# Altium project rk3288_backend.PrjPcb
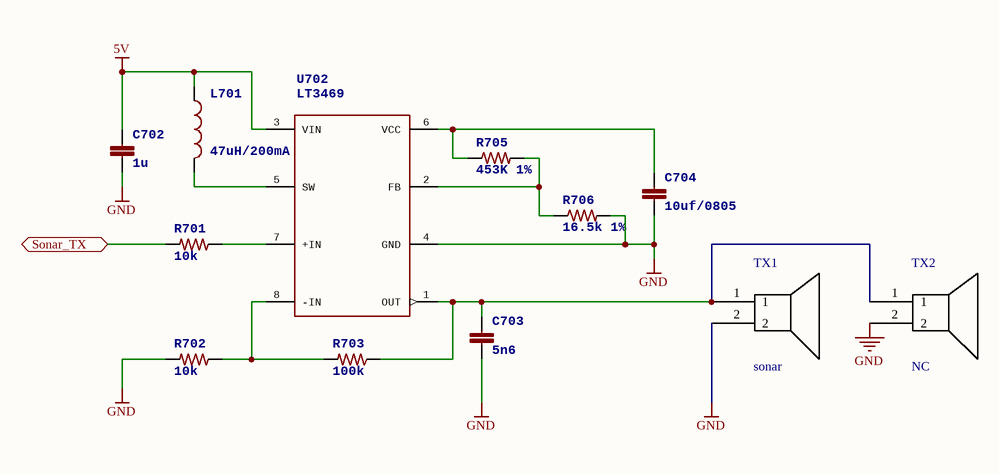
[diagram p0: sonar_tx.SchDoc]
8 sheets, 208 parts. Net scope: flat (ports and power ports of the same name join across sheets).
Board file: rk3288_backend.PcbDoc
Sheets:
  sonar_tx.SchDoc
  sonar_rx.SchDoc
  power.SchDoc
  mcu.SchDoc
  sensor.SchDoc
  connector.SchDoc
  PiAttachment.SchDoc
  rk3288.SchDoc

## Sheet sonar_tx.SchDoc
size A4

### Parts
C702  1u  [0402]
C703  5n6  [0402]
C704  10uf/0805  [0805]
L701  47uH/200mA  [L3521]
R701  10k  [0402]
R702  10k  [0402]
R703  100k  [0402]
R705  453K 1%  [0402]
R706  16.5k 1%  [0402]
TX1  sonar  [sonar-16mm]
TX2  NC  [sonar-10mm]
U702  LT3469  [SOT23-8]

### Ports
Sonar_TX

### Nets
5V: C702.1 L701.1 U702.3(VIN)
GND: C702.2 C703.2 C704.2 R702.2 R706.2 TX1.2 TX2.2 U702.4(GND)
NetC703_1: C703.1 R703.1 TX1.1 TX2.1 U702.1(OUT)
NetC704_1: C704.1 R705.1 U702.6(VCC)
NetL701_2: L701.2 U702.5(SW)
NetMCU1_24: R701.2 ; port Sonar_TX
NetR701_1: R701.1 U702.7(+IN)
NetR702_1: R702.1 R703.2 U702.8(-IN)
NetR705_2: R705.2 R706.1 U702.2(FB)

### Library data of the parts
C702 = CAP0603: <b>Capacitor</b> / Standard 0603 ceramic capacitor, and 0.1" leaded capacitor.; PARTNO: CC0603ZRY5V7BB105
C703 = CAP0402: <b>Capacitor</b> / Standard 0603 ceramic capacitor, and 0.1" leaded capacitor.; PARTNO: C0402C562K5RACTU
C704 = CAP0402: <b>Capacitor</b> / Standard 0603 ceramic capacitor, and 0.1" leaded capacitor.; PARTNO: C1005X5R1C474K050BC
L701 = INDUCTOR0805: <b>Inductors</b> / Basic Inductor/Choke - 0603 and 1210. Footprints are not proven and vary greatly between part numbers. / SRR1210: Bourns SRR1210 parts, e.g. SRR1210-100M; PARTNO: MLZ2012M470W
R701-R703 R705 R706 = RESISTOR0402-RES: <b>Resistor</b> / Basic schematic elements and footprints for 0603, 1206, and PTH 1/10th watt (small) resistors.; PARTNO: RMCF0402FT453K
TX2 = sonar
U702 = LT3469: LT3469 Piezo microactuator driver with boost regulator; PARTNO: LT3469ETS8

## Sheet sonar_rx.SchDoc
size A4
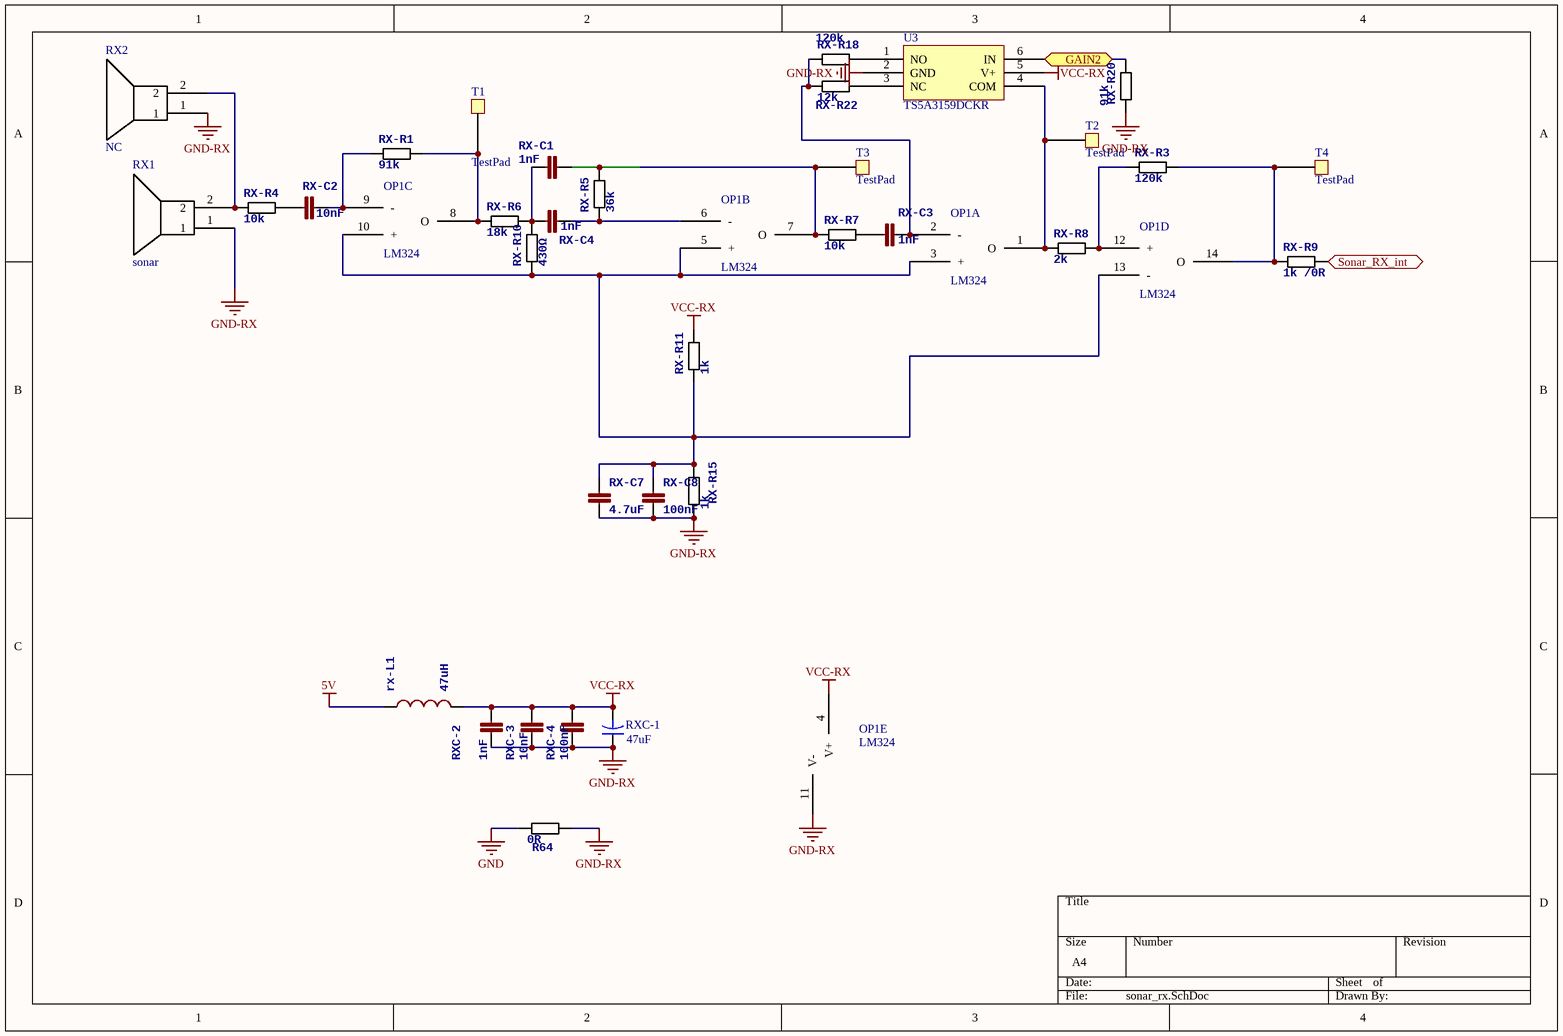
[diagram p1: sonar_rx.SchDoc]

### Parts
OP1  LM324  (parts A,B,C,D,E of 5)
R64  0R  [0402]
RX1  sonar  [sonar-16mm]
RX2  NC  [sonar-10mm]
RX-C1  1nF  [0402]
RX-C2  10nF  [0402]
RX-C3  1nF  [0402]
RX-C4  1nF  [0402]
RX-C7  4.7uF  [0402]
RX-C8  100nF  [0402]
rx-L1  47uH  [0805-IND]
RX-R1  91k  [0402]
RX-R3  120k  [0402]
RX-R4  10k  [0402]
RX-R5  36k  [0402]
RX-R6  18k  [0402]
RX-R7  10k  [0402]
RX-R8  2k  [0402]
RX-R9  1k /0R  [0402]
RX-R10  430Ω  [0402]
RX-R11  1k  [0402]
RX-R15  1k  [0402]
RX-R18  120k  [0402]
RX-R20  91k  [0402]
RX-R22  12k  [0402]
RXC-1  47uF  [C0805]
RXC-2  1nF  [0402]
RXC-3  10nF  [0402]
RXC-4  100nF  [0402]
T1  TestPad  [TestPad - 1mm]
T2  TestPad  [TestPad - 1mm]
T3  TestPad  [TestPad - 1mm]
T4  TestPad  [TestPad - 1mm]
U3  TS5A3159DCKR  [LC-SC-70-6(SOT-363)]

### Ports
GAIN2, Sonar_RX_int

### Nets
5V: rx-L1.1
GND: R64.1
GND-RX: OP1.11(V-) R64.2 RX1.1 RX2.1 RX-C7.2 RX-C8.2 RX-R15.1 RX-R20.1 RXC-1.1 RXC-2.1 RXC-3.1 RXC-4.1 U3.2(GND)
VCC-RX: OP1.4(V+) rx-L1.2 RX-R11.2 RXC-1.2 RXC-2.2 RXC-3.2 RXC-4.2 U3.5(V+)
NetMCU1_25: RX-R9.2 ; port Sonar_RX_int
NetOP1_1: OP1.1(O) RX-R8.1 T2.1 U3.4(COM)
NetOP1_2: OP1.2(-) RX-C3.2 RX-R18.1 RX-R22.1
NetOP1_3: OP1.3(+) OP1.5(+) OP1.10(+) OP1.13(-) RX-C7.1 RX-C8.1 RX-R10.1 RX-R11.1 RX-R15.2
NetOP1_6: OP1.6(-) RX-C4.2 RX-R5.1
NetOP1_7: OP1.7(O) RX-C1.2 RX-R5.2 RX-R7.1 T3.1
NetOP1_8: OP1.8(O) RX-R1.2 RX-R6.1 T1.1
NetOP1_9: OP1.9(-) RX-C2.2 RX-R1.1
NetOP1_12: OP1.12(+) RX-R3.1 RX-R8.2
NetOP1_14: OP1.14(O) RX-R3.2 RX-R9.1 T4.1
NetRX1_2: RX1.2 RX2.2 RX-R4.1
NetRX-C1_1: RX-C1.1 RX-C4.1 RX-R6.2 RX-R10.2
NetRX-C2_1: RX-C2.1 RX-R4.2
NetRX-C3_1: RX-C3.1 RX-R7.2
NetRX-R18_2: RX-R18.2 U3.1(NO)
NetRX-R20_2: RX-R20.2 U3.6(IN) ; port GAIN2
NetRX-R22_2: RX-R22.2 U3.3(NC)

### Library data of the parts
OP1 = OP-SOP14
R64 RX-R1 RX-R3-RX-R11 RX-R15 RX-R18 RX-R20 RX-R22 = RESISTOR0603B: <b>Resistor</b> / Basic schematic elements and footprints for 0603, 1206, and PTH 1/10th watt (small) resistors.; PARTNO: RMCF0402FT453K
RX2 = sonar
RX-C1-RX-C4 RXC-2-RXC-4 = CAP0603H: <b>Capacitor</b> / Standard 0603 ceramic capacitor, and 0.1" leaded capacitor.; PARTNO: CC0603ZRY5V7BB105
RX-C7 RX-C8 = CAP0603: as C702 on sheet sonar_tx
rx-L1 = INDUCTOR0805: as L701 on sheet sonar_tx
RXC-1 = Cap2: Capacitor; Published: 23-Sep-2002; PackageReference: CAPR5-4X5; Publisher: Altium Limited; PackageDescription: Capacitor; 2 Leads; Value: 47uF
U3 = TS5A3159

## Sheet power.SchDoc
size A4
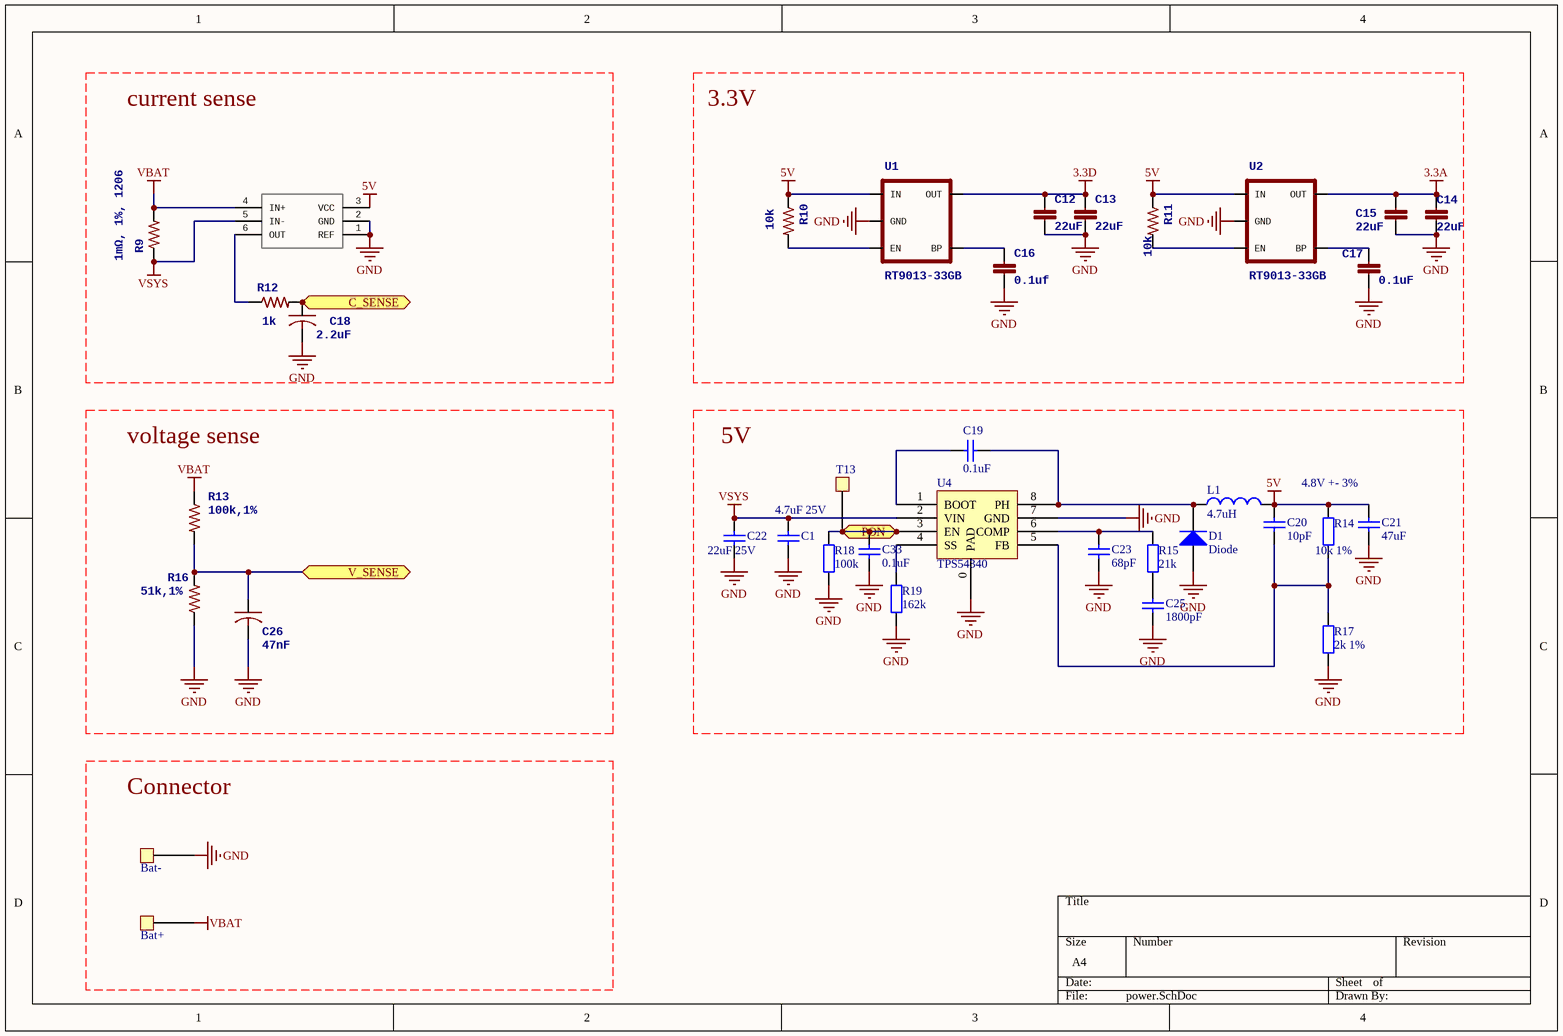
[diagram p2: power.SchDoc]

### Parts
Bat+  TestPad  [BatteryHole]  (value not drawn)
Bat-  TestPad  [BatteryHole]  (value not drawn)
C1  value 4.7uF 25V  [0805]  (hidden comment: Cap)
C12  22uF  [0805]
C13  22uF  [0805]
C14  22uF  [0805]
C15  22uF  [0805]
C16  0.1uf  [0402]
C17  0.1uF  [0402]
C18  2.2uF  [0402]
C19  value 0.1uF  [0402]  (hidden comment: Cap)
C20  value 10pF  [0402]  (hidden comment: Cap)
C21  value 47uF  [1210]  (hidden comment: Cap)
C22  value 22uF 25V  [1210]  (hidden comment: Cap)
C23  value 68pF  [0402]  (hidden comment: Cap)
C25  value 1800pF  [0402]  (hidden comment: Cap)
C26  47nF  [0402]
C33  value 0.1uF  [0402]  (hidden comment: Cap)
D1  Diode  [LC-SMB(DO-214AA)_S1]
L1  value 4.7uH  [L7022]  (hidden comment: Inductor)
R9  1mΩ, 1%, 1206  [1206]
R10  10k  [0402]
R11  10k  [0402]
R12  1k  [0402]
R13  100k,1%  [0402]
R14  value 10k 1%  [0402]  (hidden comment: Res2)
R15  value 21k  [0402]  (hidden comment: Res2)
R16  51k,1%  [0402]
R17  value 2k 1%  [0402]  (hidden comment: Res2)
R18  value 100k  [0402]  (hidden comment: Res2)
R19  value 162k  [0402]  (hidden comment: Res2)
T13  TestPad  [TestPad - 1mm]  (value not drawn)
U1  RT9013-33GB  [SOT23-5]
U2  RT9013-33GB  [SOT23-5]
U4  TPS54340  [D8-Pad]
U6  INA199  [LC-SC-70-6(SOT-363)]  (value not drawn)

### Ports
C_SENSE, PON, V_SENSE

### Nets
3.3A: C14.1 C15.1 U2.5(OUT)
3.3D: C12.1 C13.1 U1.5(OUT)
5V: C20.1 C21.1 L1.2 R10.1 R11.1 R14.1 U1.1(IN) U2.1(IN) U6.3(VCC)
GND: Bat-.1 C1.2 C12.2 C13.2 C14.2 C15.2 C16.2 C17.2 C18.2 C21.2 C22.2 C23.2 C25.2 C26.2 C33.2 D1.1(A) R16.1 R17.2 R18.2 R19.2 U1.2(GND) U2.2(GND) U4.0(PAD) U4.7(GND) U6.1(REF) U6.2(GND)
VBAT: Bat+.1 R9.P$2 R13.1 U6.4(IN+)
VSYS: C1.1 C22.1 R9.P$1 U4.2(VIN) U6.5(IN-)
NetC16_1: C16.1 U1.4(BP)
NetC17_1: C17.1 U2.4(BP)
NetC18_1: C18.1 R12.2 ; port C_SENSE
NetC19_1: C19.1 D1.2(K) L1.1 U4.8(PH)
NetC19_2: C19.2 U4.1(BOOT)
NetC20_2: C20.2 R14.2 R17.1 U4.5(FB)
NetC23_1: C23.1 R15.1 U4.6(COMP)
NetC25_1: C25.1 R15.2
NetC26_1: C26.1 R13.2 R16.2 ; port V_SENSE
NetC33_1: C33.1 R18.1 T13.1 U4.3(EN) ; port PON
NetR10_2: R10.2 U1.3(EN)
NetR11_2: R11.2 U2.3(EN)
NetR12_1: R12.1 U6.6(OUT)
NetR19_1: R19.1 U4.4(SS)

### Notes on the sheet
- current sense
- 3.3V
- voltage sense
- 5V
- 4.8V +- 3%
- Connector

### Library data of the parts
C1 C19-C23 C25 C33 = Cap: Capacitor; Published: 8-Jun-2000; LatestRevisionDate: 17-Jul-2002; LatestRevisionNote: Re-released for DXP Platform.; PackageReference: RAD-0.3; Publisher: Altium Limited; PackageDescription: Radial Cap, Thru-Hole; 2 Leads; 0.3 in Pin Spacing
C12-C17 = CAP0402-CAP: <b>Capacitor</b> / Standard 0603 ceramic capacitor, and 0.1" leaded capacitor.; PARTNO: CC0402ZRY5V7BB104
C18 C26 = C-USC0402: <B>CAPACITOR</B>, American symbol
D1 = Diode: Default Diode; Published: 8-Jun-2000; LatestRevisionDate: 17-Jul-2002; LatestRevisionNote: Re-released for DXP Platform.; PackageVersion: Sep-1996; PackageReference: SMC; Publisher: Altium Limited; PackageDescription: DO-214-AB/SMC; 2 C-Bend Leads; Body 7.9 x 5.9 mm, inc. leads (LxW); Code_JEDEC: DO-214-AB
L1 = Inductor: Code_IEC: 1005; Published: 8-Jun-2000; LatestRevisionDate: 29-May-2009; LatestRevisionNote: IPC-7351 Footprint Added.; PackageReference: 0402-A; Publisher: Altium Limited; PackageDescription: Chip Inductor; Code_JEITA: 0402
R9 = CSS2725FTL250: pin to pad: P$1>2 P$2>1; DIGIKEY: http://search.digikey.com/us/en/products/CSS2725FTL250/CSS2725FTL250CT-ND/1923235; MFGPN: CSS2725FTL250
R10-R13 R16 = RESISTOR0402-RES: <b>Resistor</b> / Basic schematic elements and footprints for 0603, 1206, and PTH resistors.
R14 R15 R17-R19 = Res2: Resistor; Published: 8-Jun-2000; LatestRevisionDate: 17-Jul-2002; LatestRevisionNote: Re-released for DXP Platform.; PackageReference: AXIAL-0.4; Publisher: Altium Limited; PackageDescription: Axial Device, Thru-Hole; 2 Leads; 0.4 in Pin Spacing
U1 = V_REG_LDOSMD: PARTNO: MIC5207-3.3YM5
U2 = V_REG_LDOSMD: <b>Voltage Regulator LDO</b> / Standard 150mA LDO voltage regulator in SOT-23 layout. Micrel part MIC5205. BP (by-pass) pin is used to lower output noise with 470pF cap.; PARTNO: MIC5207-3.3YM5

## Sheet mcu.SchDoc
size A4
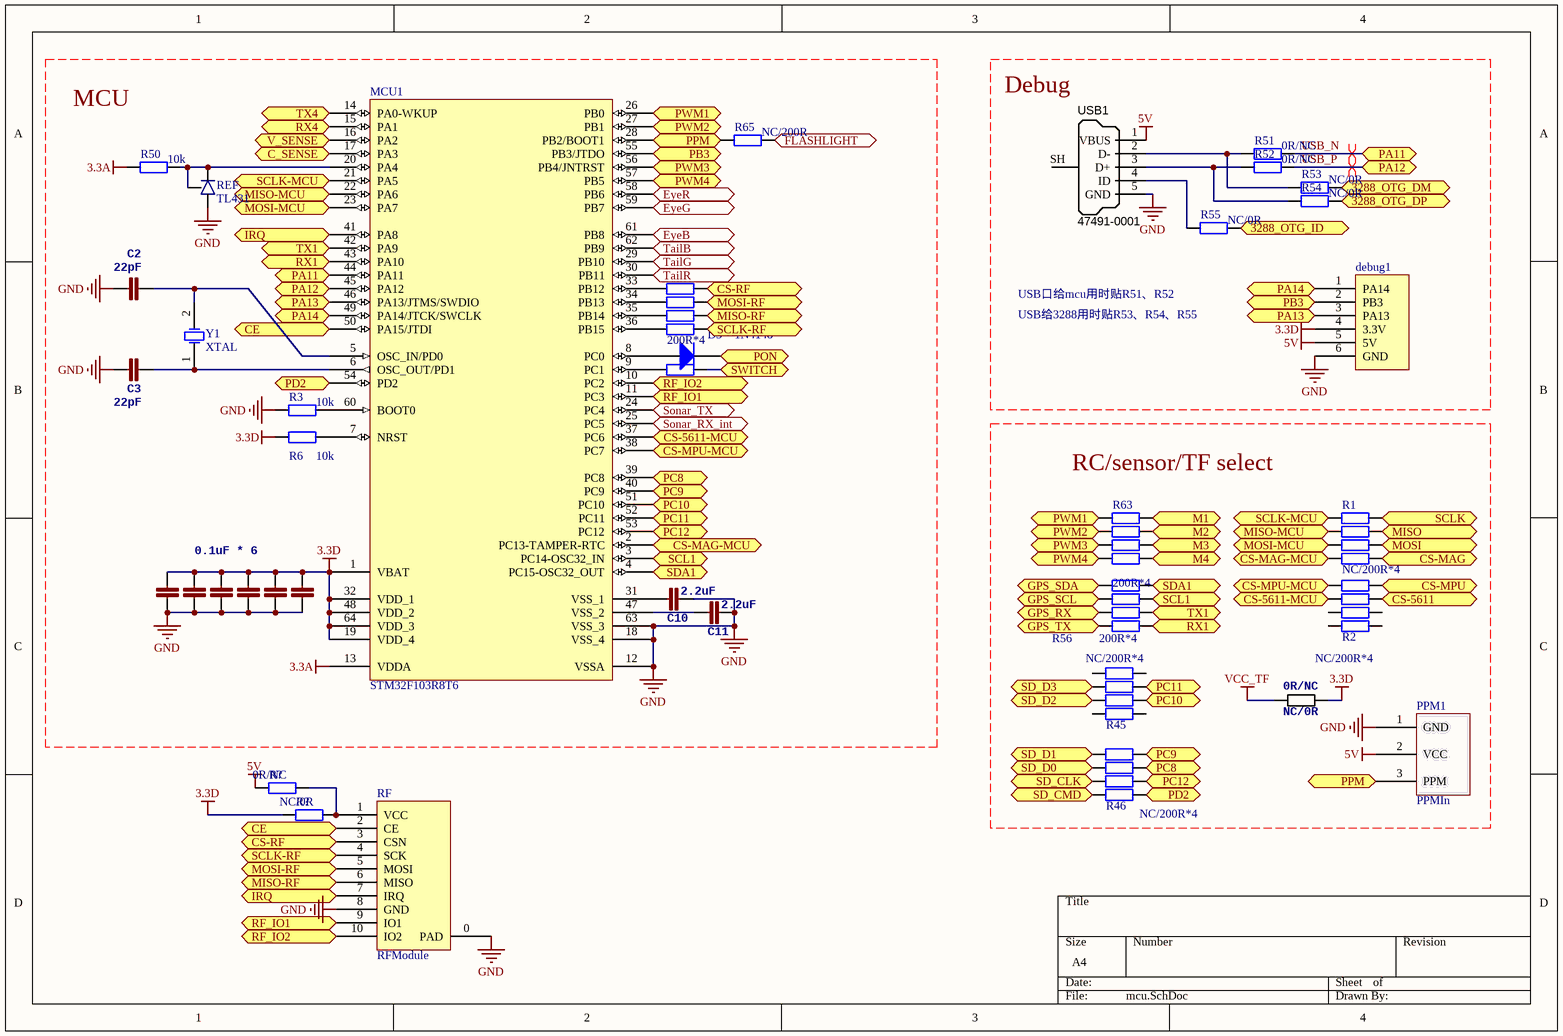
[diagram p3: mcu.SchDoc]

### Parts
(Parts that share a designator on the sheet are numbered #1, #2 ... from top to bottom, then left to right.)
0R/NC  NC/0R  [0402]
C2  22pF  [0402]
C3  22pF  [0402]
C4  0.1uF * 6  [0402]
C5  1n  [0402]  (value not drawn)
C6  1n  [0402]  (value not drawn)
C7  1n  [0402]  (value not drawn)
C8  1n  [0402]  (value not drawn)
C9  1n  [0402]  (value not drawn)
C10  2.2uF  [0603]
C11  2.2uF  [0603]
D3  1N4148  [LC-SOD-323]
debug1  debug  [WFRSM125]  (value not drawn)
MCU1  STM32F103R8T6  [LQFP64_N]
PPM1  PPMIn  [ServoConnector]
R1  NC/200R*4  [0402X4]
R2  NC/200R*4  [0402X4]
R3  10k  [0402]
R6  10k  [0402]
R8  200R*4  [0402X4]
R44  1k  [0402]
R45  NC/200R*4  [0402X4]
R46  NC/200R*4  [0402X4]
R50  10k  [0402]
R51  0R/NC  [0402]
R52  0R/NC  [0402]
R53  NC/0R  [0402]
R54  NC/0R  [0402]
R55  NC/0R  [0402]
R56  200R*4  [0402X4]
R63  200R*4  [0402X4]
R65  NC/200R  [0402]
R?#1  value 0R/NC  [0402]
R?#2  value NC/0R  [0402]
REF  TL431  [SOT-23B_L]
RF  RFModule  [RFModule]
USB1  Manufacturer Part Number 1: 47491-0001  [MOLEX-47346-0001]  (hidden comment: USB Micro Type B)
Y1  XTAL  [5032]

### Ports
3288_OTG_DM, 3288_OTG_DP, 3288_OTG_ID, C_SENSE, CE, CS-5611, CS-5611-MCU, CS-MAG (bidir), CS-MAG-MCU (bidir), CS-MPU, CS-MPU-MCU, CS-RF, EyeB, EyeG, EyeR, FLASHLIGHT, GPS_RX, GPS_SCL, GPS_SDA, GPS_TX, IRQ, M1, M2, M3, M4, MISO, MISO-MCU, MISO-RF, MOSI, MOSI-MCU, MOSI-RF, PA11, PA12, PA13, PA14, PB3, PC8, PC9, PC10, PC11, PC12, PD2, PON, PPM, PWM1, PWM2, PWM3, PWM4, RF_IO1, RF_IO2, RX1, RX4, SCL1, SCLK, SCLK-MCU, SCLK-RF, SD_CLK, SD_CMD, SD_D0, SD_D1, SD_D2, SD_D3, SDA1, Sonar_RX_int, Sonar_TX, SWITCH, TailB, TailG, TailR, TX1, TX4, V_SENSE

### Nets
3.3A: MCU1.13(VDDA) R50.1
3.3D: 0R/NC.2 C4.2 C5.2 C6.2 C7.2 C8.2 C9.2 debug1.4(3.3V) MCU1.1(VBAT) MCU1.19(VDD_4) MCU1.32(VDD_1) MCU1.48(VDD_2) MCU1.64(VDD_3) R6.2 R?#2.1
5V: debug1.5(5V) PPM1.2(VCC) R?#1.1 USB1.1(VBUS)
GND: C2.2 C3.2 C4.1 C5.1 C6.1 C7.1 C8.1 C9.1 C10.2 C11.2 debug1.6(GND) MCU1.12(VSSA) MCU1.18(VSS_4) MCU1.63(VSS_3) PPM1.1(GND) R3.1 REF.3(ANODE) RF.0(PAD) RF.8(GND) USB1.5(GND)
VCC_TF: 0R/NC.1
3288_OTG_N: R53.2 ; port 3288_OTG_DM
3288_OTG_P: R54.2 ; port 3288_OTG_DP
USB_N: MCU1.44(PA11) R51.2 ; port PA11
USB_P: MCU1.45(PA12) R52.2 ; port PA12
NetBaro1_5: R2.7 ; port CS-5611
NetBaro1_6: R1.2 ; port MISO
NetBaro1_7: R1.3 ; port MOSI
NetBaro1_8: R1.1 ; port SCLK
NetC2_1: C2.1 MCU1.5(OSC_IN/PD0) Y1.2(OSC2)
NetC3_1: C3.1 MCU1.6(OSC_OUT/PD1) Y1.1(OSC1)
NetC10_1: C10.1 MCU1.31(VSS_1)
NetC11_1: C11.1 MCU1.47(VSS_2)
NetC18_1: MCU1.17(PA3) ; port C_SENSE
NetC26_1: MCU1.16(PA2) ; port V_SENSE
NetC33_1: D3.2(K) ; port PON
NetD3_1: D3.1(A) MCU1.8(PC0)
NetD4_1: R44.1 ; port SWITCH
Netdebug1_1: debug1.1(PA14) MCU1.49(PA14/JTCK/SWCLK) ; port PA14
Netdebug1_2: debug1.2(PB3) MCU1.55(PB3/JTDO) ; port PB3
Netdebug1_3: debug1.3(PA13) MCU1.46(PA13/JTMS/SWDIO) ; port PA13
NetGPS1_3: R56.8 ; port GPS_TX
NetGPS1_4: R56.7 ; port GPS_RX
NetGPS1_5: R56.6 ; port GPS_SCL
NetGPS1_6: R56.5 ; port GPS_SDA
Netimu1_8: R2.8 ; port CS-MPU
NetM1_2: R63.1 ; port M1
NetM2_2: R63.2 ; port M2
NetM3_2: R63.3 ; port M3
NetM4_2: R63.4 ; port M4
NetMCU1_2: MCU1.2(PC13-TAMPER-RTC) R1.5 ; port CS-MAG-MCU
NetMCU1_3: MCU1.3(PC14-OSC32_IN) R56.3 ; port SCL1
NetMCU1_4: MCU1.4(PC15-OSC32_OUT) R56.4 ; port SDA1
NetMCU1_7: MCU1.7(NRST) R6.1
NetMCU1_9: MCU1.9(PC1) R44.2
NetMCU1_10: MCU1.10(PC2) RF.10(IO2) ; port RF_IO2
NetMCU1_11: MCU1.11(PC3) RF.9(IO1) ; port RF_IO1
NetMCU1_14: MCU1.14(PA0-WKUP) ; port TX4
NetMCU1_15: MCU1.15(PA1) ; port RX4
NetMCU1_20: MCU1.20(PA4) R50.2 REF.1(REF) REF.2(CATHODE)
NetMCU1_21: MCU1.21(PA5) R1.8 ; port SCLK-MCU
NetMCU1_22: MCU1.22(PA6) R1.7 ; port MISO-MCU
NetMCU1_23: MCU1.23(PA7) R1.6 ; port MOSI-MCU
NetMCU1_24: MCU1.24(PC4) ; port Sonar_TX
NetMCU1_25: MCU1.25(PC5) ; port Sonar_RX_int
NetMCU1_26: MCU1.26(PB0) R63.8 ; port PWM1
NetMCU1_27: MCU1.27(PB1) R63.7 ; port PWM2
NetMCU1_28: MCU1.28(PB2/BOOT1) PPM1.3(PPM) R65.1 ; port PPM
NetMCU1_29: MCU1.29(PB10) ; port TailG
NetMCU1_30: MCU1.30(PB11) ; port TailR
NetMCU1_33: MCU1.33(PB12) R8.4
NetMCU1_34: MCU1.34(PB13) R8.3
NetMCU1_35: MCU1.35(PB14) R8.2
NetMCU1_36: MCU1.36(PB15) R8.1
NetMCU1_37: MCU1.37(PC6) R2.2 ; port CS-5611-MCU
NetMCU1_38: MCU1.38(PC7) R2.1 ; port CS-MPU-MCU
NetMCU1_39: MCU1.39(PC8) R46.7 ; port PC8
NetMCU1_40: MCU1.40(PC9) R46.8 ; port PC9
NetMCU1_41: MCU1.41(PA8) RF.7(IRQ) ; port IRQ
NetMCU1_42: MCU1.42(PA9) R56.2 ; port TX1
NetMCU1_43: MCU1.43(PA10) R56.1 ; port RX1
NetMCU1_50: MCU1.50(PA15/JTDI) RF.2(CE) ; port CE
NetMCU1_51: MCU1.51(PC10) R45.6 ; port PC10
NetMCU1_52: MCU1.52(PC11) R45.7 ; port PC11
NetMCU1_53: MCU1.53(PC12) R46.6 ; port PC12
NetMCU1_54: MCU1.54(PD2) R46.5 ; port PD2
NetMCU1_56: MCU1.56(PB4/JNTRST) R63.6 ; port PWM3
NetMCU1_57: MCU1.57(PB5) R63.5 ; port PWM4
NetMCU1_58: MCU1.58(PB6) ; port EyeR
NetMCU1_59: MCU1.59(PB7) ; port EyeG
NetMCU1_60: MCU1.60(BOOT0) R3.2
NetMCU1_61: MCU1.61(PB8) ; port EyeB
NetMCU1_62: MCU1.62(PB9) ; port TailB
NetP5_4: R55.2 ; port 3288_OTG_ID
NetR1_4: R1.4 ; port CS-MAG
NetR8_5: R8.5 RF.3(CSN) ; port CS-RF
NetR8_6: R8.6 RF.5(MOSI) ; port MOSI-RF
NetR8_7: R8.7 RF.6(MISO) ; port MISO-RF
NetR8_8: R8.8 RF.4(SCK) ; port SCLK-RF
NetR43_2: R65.2 ; port FLASHLIGHT
NetR45_2: R45.2 ; port SD_D3
NetR45_3: R45.3 ; port SD_D2
NetR46_1: R46.1 ; port SD_D1
NetR46_2: R46.2 ; port SD_D0
NetR46_3: R46.3 ; port SD_CLK
NetR46_4: R46.4 ; port SD_CMD
NetR51_1: R51.1 R53.1 USB1.2(D-)
NetR52_1: R52.1 R54.1 USB1.3(D+)
NetR55_1: R55.1 USB1.4(ID)
NetR?#1_2: R?#1.2 R?#2.2 RF.1(VCC)

Not connected (* = marked no-connect by the designer): R2 3 4 5 6; R45 1 4 5 8; USB1 SH(Shell)

### Layout directives
differential pair: USB_N, USB_P

### Notes on the sheet
- MCU
- (near USB1) Debug
- USB口给mcu用时贴R51、R52
- USB给3288用时贴R53、R54、R55
- RC/sensor/TF select

### Library data of the parts
0R/NC = RESISTOR0603B: as R64 on sheet sonar_rx
C2-C11 = CAP0402-CAP: as C12 on sheet power
D3 = Diode 1N4148: High Conductance Fast Diode; Published: 8-Jun-2000; LatestRevisionDate: 17-Jul-2002; LatestRevisionNote: Re-released for DXP Platform.; DatasheetVersion: 1997; PackageReference: DO-35; Publisher: Altium Limited; PackageDescription: Diode, Axial; Body 3.8 x 1.9 mm (LxDia. max), Lead Dia. 0.53 mm (max); Code_JEDEC: DO-204-AH; ComponentLink1Description: Manufacturer Link; ComponentLink1URL: http://www.fairchildsemi.com/; ComponentLink2Description: Datasheet; ComponentLink2URL: http://www.fairchildsemi.com/ds/1N%2F1N4148.pdf
MCU1 = STM32F103R8T6: STM32 ARM-based 32-bit MCU with 64 Kbytes Flash, 64-pin LQFP, Industrial Temperature; Published: *; DatasheetVersion: *; PackageVersion: *; PackageReference: *; Publisher: *; PackageDescription: *; ComponentLink1Description: *; ComponentLink1URL: *; ComponentLink2Description: *; ComponentLink2URL: *
R1 R2 R8 R45 R46 R56 R63 = Res*4: Resistor; Published: 8-Jun-2000; LatestRevisionDate: 17-Jul-2002; LatestRevisionNote: Re-released for DXP Platform.; PackageReference: AXIAL-0.4; Publisher: Altium Limited; PackageDescription: Axial Device, Thru-Hole; 2 Leads; 0.4 in Pin Spacing
R3 R6 R44 R50-R55 R65 = Res2: Resistor; Value: 0Ohm; Published: 8-Jun-2000; LatestRevisionDate: 17-Jul-2002; LatestRevisionNote: Re-released for DXP Platform.; PackageReference: AXIAL-0.4; Publisher: Altium Limited; PackageDescription: Axial Device, Thru-Hole; 2 Leads; 0.4 in Pin Spacing
R?#1 R?#2 = Res2: Resistor; Published: 8-Jun-2000; LatestRevisionDate: 17-Jul-2002; LatestRevisionNote: Re-released for DXP Platform.; PackageReference: AXIAL-0.4; Publisher: Altium Limited; PackageDescription: Axial Device, Thru-Hole; 2 Leads; 0.4 in Pin Spacing
USB1 = USB_Micro_TypeB: Connector SMD USB Micro Type B middle mount; Manufacturer 1: Molex Inc; SCDType: undef; Package / Case: SMD; Supplier 1: Digi-Key; Supplier Part Number 1: WM17142CT-ND
Y1 = XTAL: Crystal Oscillator; Published: 8-Jun-2000; LatestRevisionDate: 17-Jul-2002; LatestRevisionNote: Re-released for DXP Platform.; PackageReference: R38; Publisher: Altium Limited; PackageDescription: Crystal, Thru-Hole; 2 Leads; Body 3.1 x 8.2 mm (Dia.xH)

## Sheet sensor.SchDoc
size A4
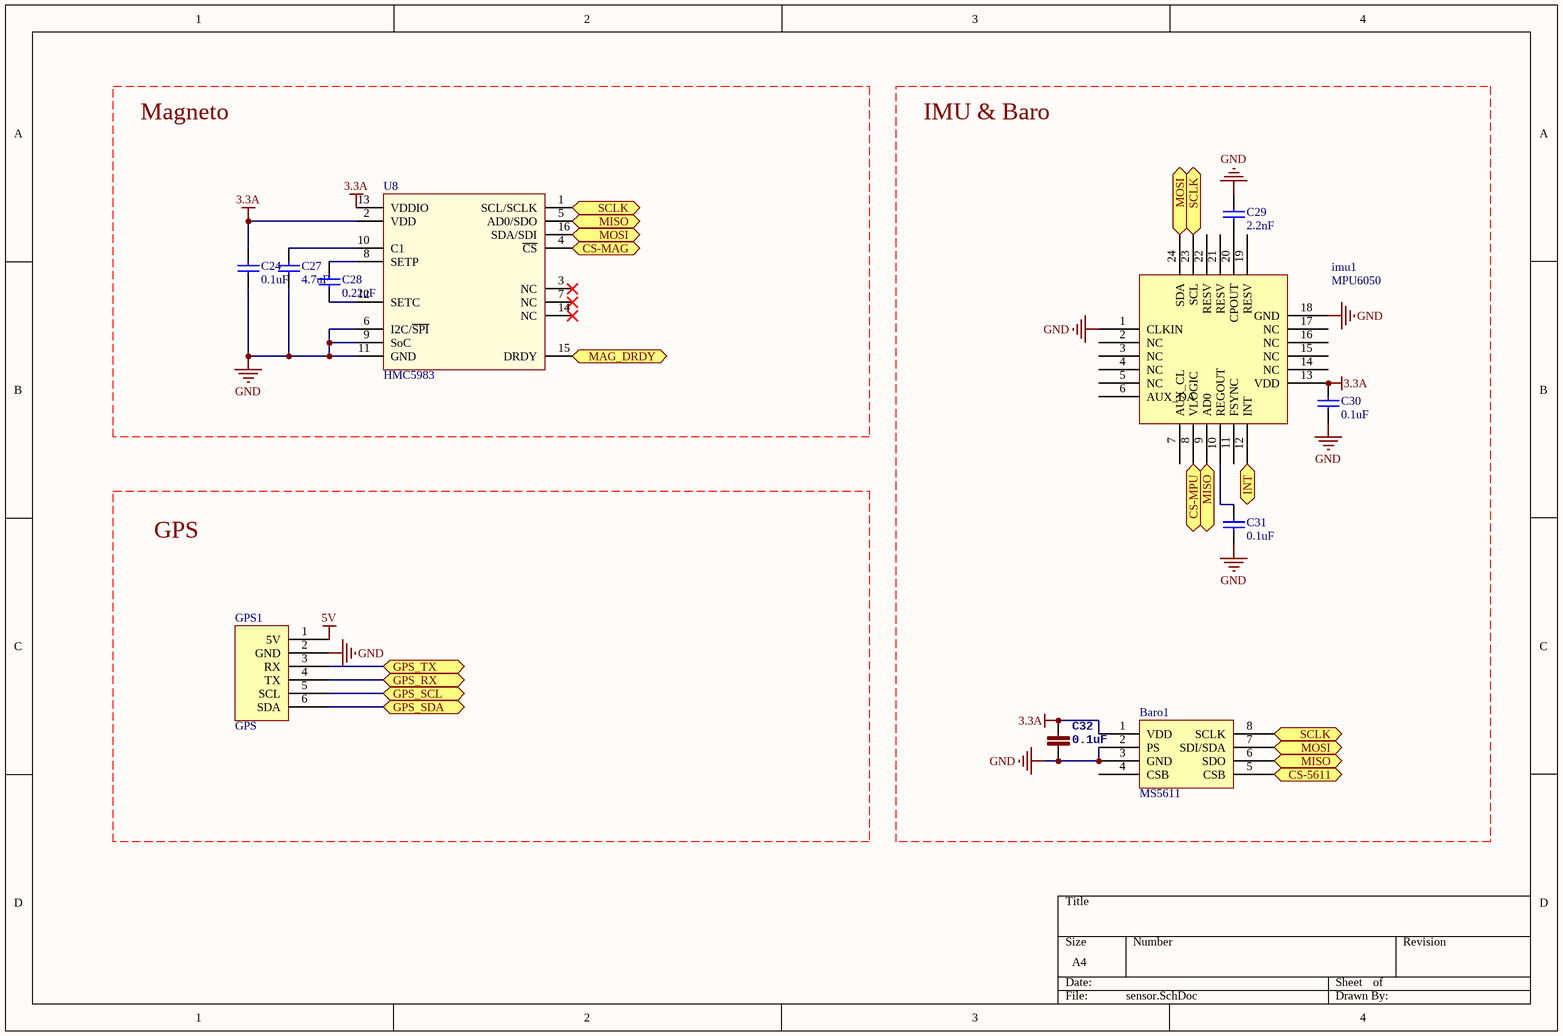
[diagram p4: sensor.SchDoc]

### Parts
Baro1  MS5611  [MS5611]
C24  0.1uF  [0402]
C27  4.7uF  [0805]
C28  0.22uF  [0402]
C29  2.2nF  [0402]
C30  0.1uF  [0402]
C31  0.1uF  [0402]
C32  0.1uF  [0402]
GPS1  GPS  [WFRSM125]
imu1  MPU6050  [MPU6050-2]
U8  HMC5983  [HMC5883-MAN]

### Ports
CS-5611, CS-MAG (bidir), CS-MPU, GPS_RX, GPS_SCL, GPS_SDA, GPS_TX, INT, MAG_DRDY (bidir), MISO, MOSI, SCLK

### Nets
3.3A: Baro1.1(VDD) C24.2 C30.2 C32.1 imu1.13(VDD) U8.2(VDD) U8.13(VDDIO)
5V: GPS1.1(5V)
GND: Baro1.2(PS) Baro1.3(GND) C24.1 C27.1 C29.2 C30.1 C31.1 C32.2 GPS1.2(GND) imu1.1(CLKIN) imu1.18(GND) U8.6(I2C/~{SPI}) U8.9(SoC) U8.11(GND)
NetBaro1_5: Baro1.5(CSB) ; port CS-5611
NetBaro1_6: Baro1.6(SDO) imu1.9(AD0) U8.5(AD0/SDO) ; port MISO
NetBaro1_7: Baro1.7(SDI/SDA) imu1.24(SDA) U8.16(SDA/SDI) ; port MOSI
NetBaro1_8: Baro1.8(SCLK) imu1.23(SCL) U8.1(SCL/SCLK) ; port SCLK
NetC27_2: C27.2 U8.10(C1)
NetC28_1: C28.1 U8.12(SETC)
NetC28_2: C28.2 U8.8(SETP)
NetC29_1: C29.1 imu1.20(CPOUT)
NetC31_2: C31.2 imu1.10(REGOUT)
NetGPS1_3: GPS1.3(RX) ; port GPS_TX
NetGPS1_4: GPS1.4(TX) ; port GPS_RX
NetGPS1_5: GPS1.5(SCL) ; port GPS_SCL
NetGPS1_6: GPS1.6(SDA) ; port GPS_SDA
Netimu1_8: imu1.8(VLOGIC) ; port CS-MPU
Netimu1_12: imu1.12(INT) ; port INT
NetR1_4: U8.4(~{CS}) ; port CS-MAG
NetU8_15: U8.15(DRDY) ; port MAG_DRDY

Not connected (* = marked no-connect by the designer): Baro1 4(CSB); imu1 2(NC) 3(NC) 4(NC) 5(NC) 6(AUX_DA) 7(AUX_CL) 11(FSYNC) 14(NC) 15(NC) 16(NC) 17(NC) 19(RESV) 21(RESV) 22(RESV); U8 3(NC)* 7(NC)* 14(NC)*

### Notes on the sheet
- Magneto
- IMU & Baro
- GPS

### Library data of the parts
C24 C27 C28 C30 C31 = Cap: Capacitor; Published: 8-Jun-2000; LatestRevisionDate: 17-Jul-2002; LatestRevisionNote: Re-released for DXP Platform.; PackageReference: RAD-0.3; Publisher: Altium Limited; PackageDescription: Radial Cap, Thru-Hole; 2 Leads; 0.3 in Pin Spacing
  C24 C30 C31: Value: 0.1uf
C29 = Cap: Capacitor; Value: 0.1uf; Published: 8-Jun-2000; LatestRevisionDate: 17-Jul-2002; LatestRevisionNote: Re-released for DXP Platform.; PackageReference: RAD-0.3; Publisher: Altium Limited; PackageDescription: Radial Cap, Thru-Hole; 2 Leads; 0.3 in Pin Spacing
C32 = CAP0402-CAP: as C12 on sheet power
U8 = HMC5983: HMC5983 LPCC-16 MEGA

## Sheet connector.SchDoc
size A4
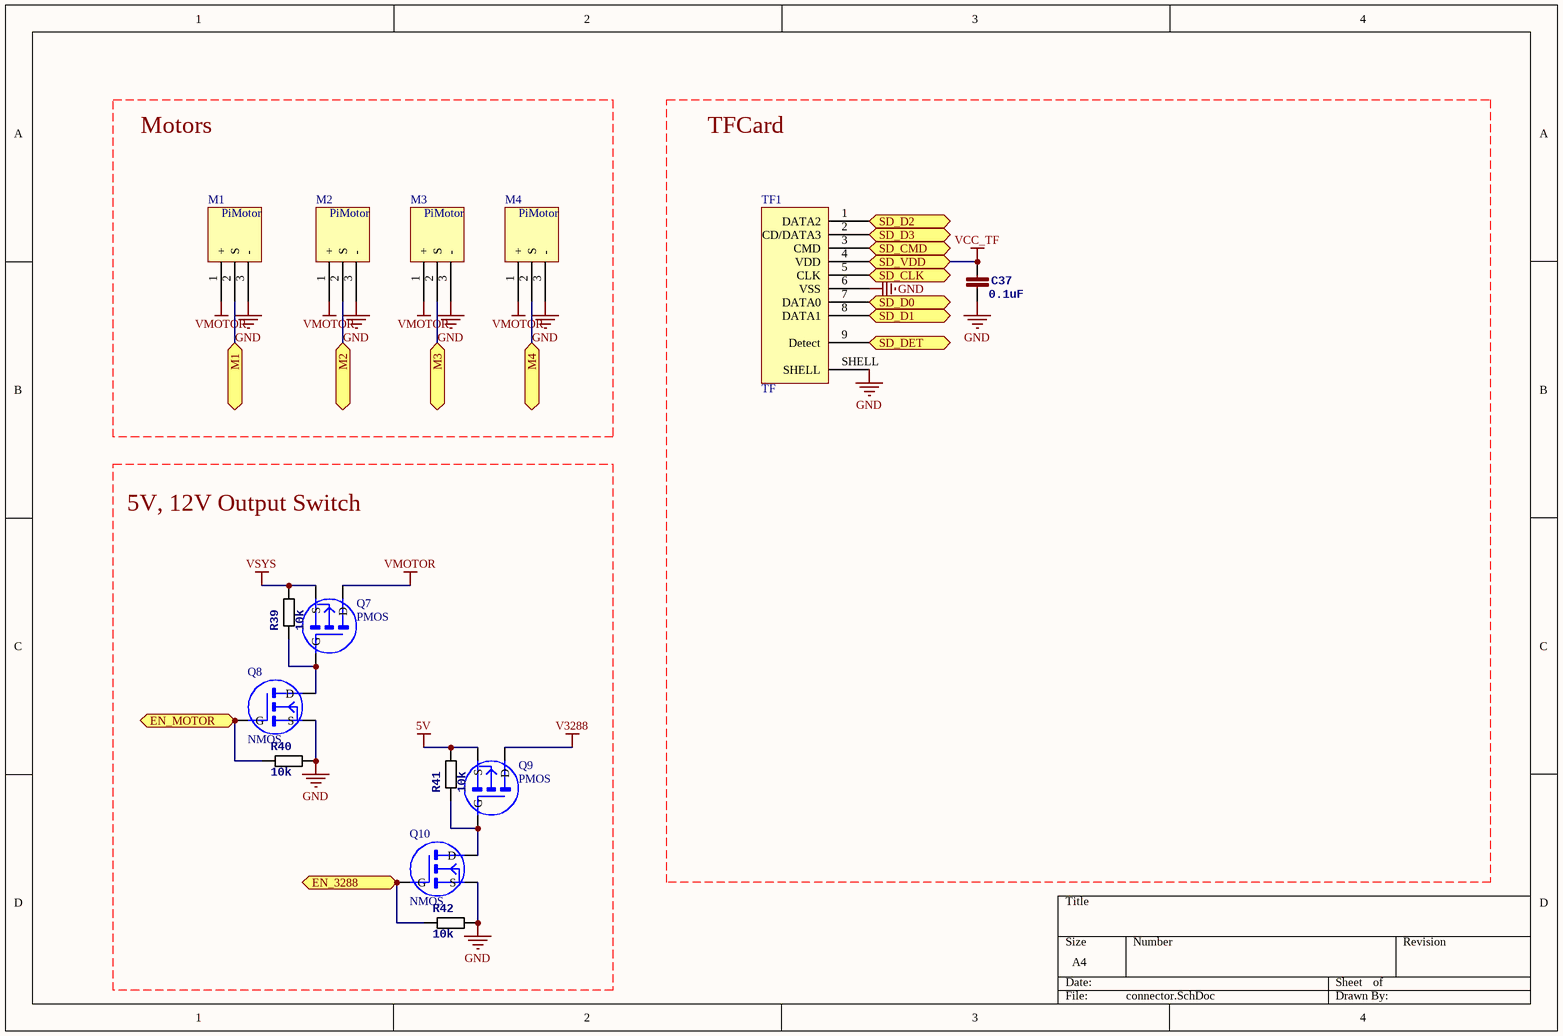
[diagram p5: connector.SchDoc]

### Parts
C37  0.1uF  [0402]
M1  PiMotor  [PiMotor]
M2  PiMotor  [PiMotor]
M3  PiMotor  [PiMotor]
M4  PiMotor  [PiMotor]
Q7  PMOS  [MOS_DFN5x6]
Q8  NMOS  [SOT23_L]
Q9  PMOS  [MOS_DFN3x3]
Q10  NMOS  [SOT23_L]
R39  10k  [0402]
R40  10k  [0402]
R41  10k  [0402]
R42  10k  [0402]
TF1  TF  [TF]

### Ports
EN_3288, EN_MOTOR, M1, M2, M3, M4, SD_CLK, SD_CMD, SD_D0, SD_D1, SD_D2, SD_D3, SD_DET, SD_VDD

### Nets
5V: Q9.S R41.2
GND: C37.1 M1.3(-) M2.3(-) M3.3(-) M4.3(-) Q8.S Q10.S R40.2 R42.2 TF1.6(VSS) TF1.SHELL
V3288: Q9.D
VCC_TF: C37.2 TF1.4(VDD) ; port SD_VDD
VMOTOR: M1.1(+) M2.1(+) M3.1(+) M4.1(+) Q7.D
VSYS: Q7.S R39.2
NetM1_2: M1.2(S) ; port M1
NetM2_2: M2.2(S) ; port M2
NetM3_2: M3.2(S) ; port M3
NetM4_2: M4.2(S) ; port M4
NetQ7_G: Q7.G Q8.D R39.1
NetQ8_G: Q8.G R40.1 ; port EN_MOTOR
NetQ9_G: Q9.G Q10.D R41.1
NetQ10_G: Q10.G R42.1 ; port EN_3288
NetR45_2: TF1.2(CD/DATA3) ; port SD_D3
NetR45_3: TF1.1(DATA2) ; port SD_D2
NetR46_1: TF1.8(DATA1) ; port SD_D1
NetR46_2: TF1.7(DATA0) ; port SD_D0
NetR46_3: TF1.5(CLK) ; port SD_CLK
NetR46_4: TF1.3(CMD) ; port SD_CMD
NetR61_3: TF1.9(Detect) ; port SD_DET

### Notes on the sheet
- Motors
- TFCard
- 5V, 12V Output Switch

### Library data of the parts
C37 = CAP0402-CAP: as C12 on sheet power
Q8 Q10 = NMOS: pin to pad: D>1 G>3 S>2
R39-R42 = RESISTOR0603B: as R64 on sheet sonar_rx

## Sheet PiAttachment.SchDoc
size A4
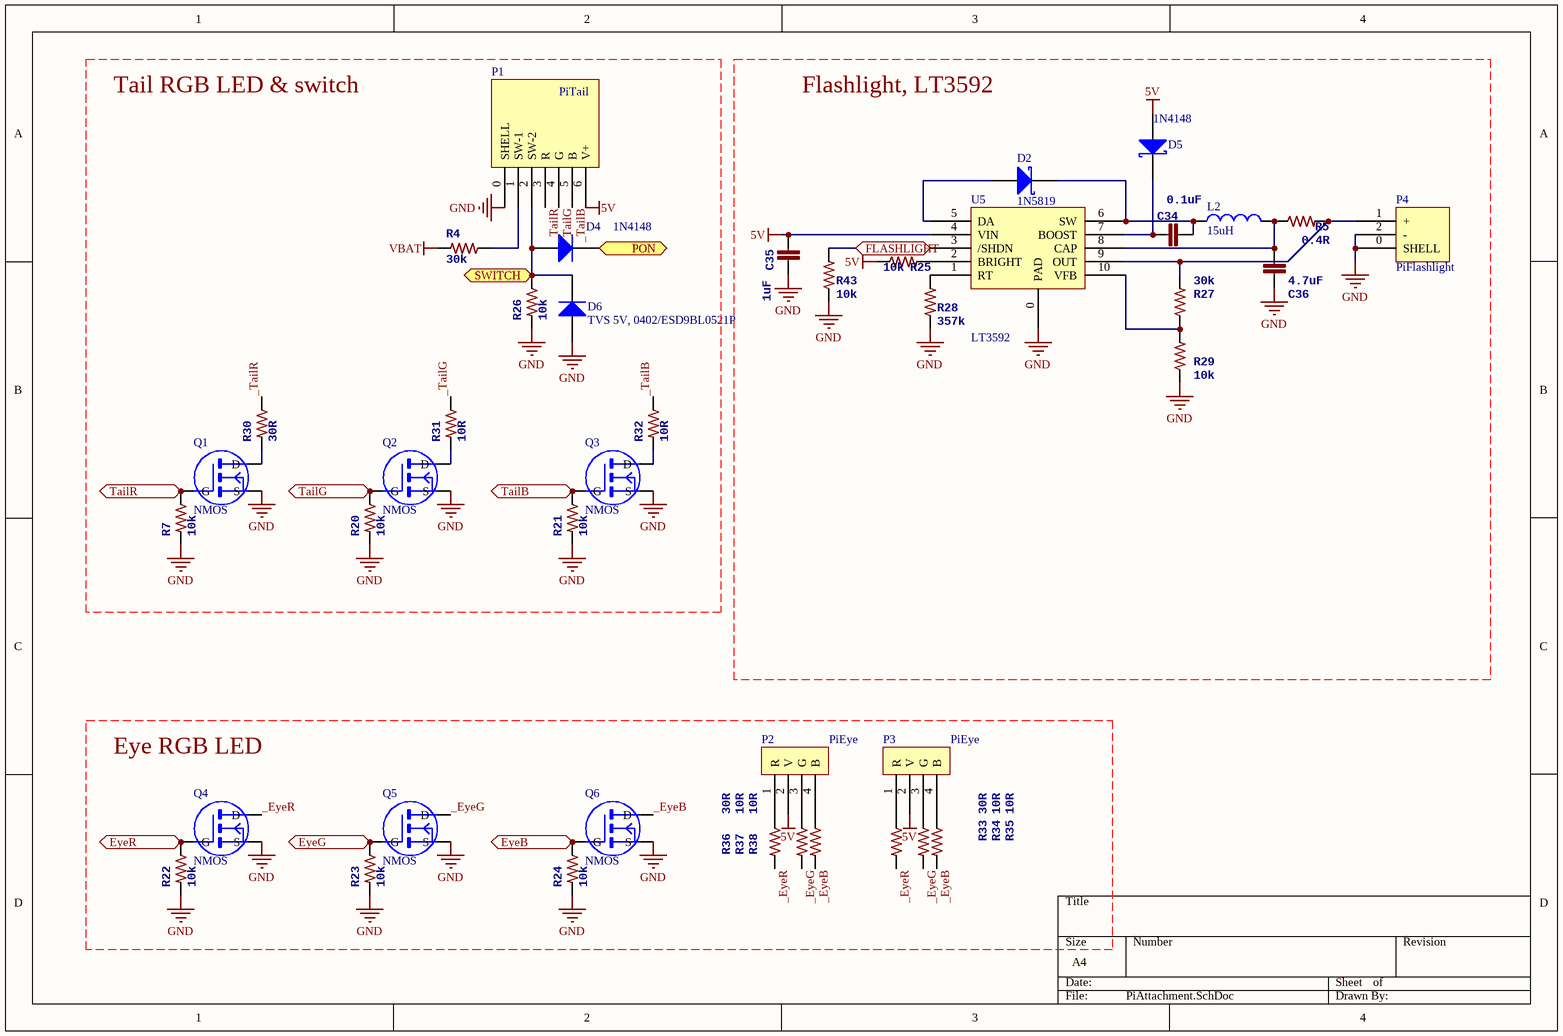
[diagram p6: PiAttachment.SchDoc]

### Parts
C34  0.1uF  [0402]
C35  1uF  [0402]
C36  4.7uF  [0805]
D2  1N5819  [SOD-123]
D4  1N4148  [LC-SOD-323]
D5  1N4148  [SOD-123]
D6  TVS 5V, 0402/ESD9BL0521P  [0402]
L2  value 15uH  [L3521]  (hidden comment: Inductor)
P1  PiTail  [FPC-0.5mm-6]
P2  PiEye  [PiEyeLED]
P3  PiEye  [PiEyeLED]
P4  PiFlashlight  [PiFlashLight]
Q1  NMOS  [SOT23_L]
Q2  NMOS  [SOT23_L]
Q3  NMOS  [SOT23_L]
Q4  NMOS  [SOT23_L]
Q5  NMOS  [SOT23_L]
Q6  NMOS  [SOT23_L]
R4  30k  [0402]
R5  0.4R  [0603]
R7  10k  [0402]
R20  10k  [0402]
R21  10k  [0402]
R22  10k  [0402]
R23  10k  [0402]
R24  10k  [0402]
R25  10k  [0402]
R26  10k  [0402]
R27  30k  [0402]
R28  357k  [0402]
R29  10k  [0402]
R30  30R  [0603]
R31  10R  [0603]
R32  10R  [0603]
R33  30R  [0603]
R34  10R  [0603]
R35  10R  [0603]
R36  30R  [0603]
R37  10R  [0603]
R38  10R  [0603]
R43  10k  [0402]
U5  LT3592  [LT3592]

### Ports
EyeB, EyeG, EyeR, FLASHLIGHT, PON, SWITCH, TailB, TailG, TailR

### Nets
5V: C35.1 D5.3(A) P1.6(V+) P2.2(V) P3.2(V) R25.1 U5.4(VIN)
GND: C35.2 C36.2 D6.1(A) P1.0(SHELL) P4.0(SHELL) P4.2(-) Q1.S Q2.S Q3.S Q4.S Q5.S Q6.S R7.2 R20.2 R21.2 R22.2 R23.2 R24.2 R26.2 R28.1 R29.1 R43.1 U5.0(PAD)
VBAT: R4.2
_EyeB: Q6.D R35.2 R38.2
_EyeG: Q5.D R34.2 R37.2
_EyeR: Q4.D R33.2 R36.2
_TailB: P1.5(B) R32.1
_TailG: P1.4(G) R31.1
_TailR: P1.3(R) R30.1
NetC33_1: D4.2(K) ; port PON
NetC34_1: C34.1 D2.1(K) L2.1 U5.6(SW)
NetC34_2: C34.2 D5.1(K) U5.7(BOOST)
NetC36_1: C36.1 L2.2 R5.1 U5.8(CAP)
NetD2_3: D2.3(A) U5.5(DA)
NetD4_1: D4.1(A) D6.2(K) P1.2(SW-2) R26.1 ; port SWITCH
NetMCU1_29: Q2.G R20.1 ; port TailG
NetMCU1_30: Q1.G R7.1 ; port TailR
NetMCU1_58: Q4.G R22.1 ; port EyeR
NetMCU1_59: Q5.G R23.1 ; port EyeG
NetMCU1_61: Q6.G R24.1 ; port EyeB
NetMCU1_62: Q3.G R21.1 ; port TailB
NetP1_1: P1.1(SW-1) R4.1
NetP2_1: P2.1(R) R36.1
NetP2_3: P2.3(G) R37.1
NetP2_4: P2.4(B) R38.1
NetP3_1: P3.1(R) R33.1
NetP3_3: P3.3(G) R34.1
NetP3_4: P3.4(B) R35.1
NetP4_1: P4.1(+) R5.2 R27.2 U5.9(OUT)
NetQ1_D: Q1.D R30.2
NetQ2_D: Q2.D R31.2
NetQ3_D: Q3.D R32.2
NetR25_2: R25.2 U5.2(BRIGHT)
NetR27_1: R27.1 R29.2 U5.10(VFB)
NetR28_2: R28.2 U5.1(RT)
NetR43_2: R43.2 U5.3(/SHDN) ; port FLASHLIGHT

### Notes on the sheet
- Tail RGB LED & switch
- Flashlight, LT3592
- Eye RGB LED

### Library data of the parts
C34-C36 = CAP0402-CAP: as C12 on sheet power
D2 D5 = Diode 10TQ035: Schottky Rectifier; Note: Terminal 2 is the TAB and is electrically connected to the cathode; Published: 8-Jun-2000; LatestRevisionDate: 17-Jul-2002; LatestRevisionNote: Re-released for DXP Platform.; DatasheetVersion: PD-2.057B; PackageVersion: Feb-1998; PackageReference: TO-220AC; Publisher: Altium Limited; PackageDescription: TO, Thru-Hole, Vertical, Heatsink Mounted; 3 In-Line Leads (1 Absent); Pitch 2.54 mm; ComponentLink1Description: Manufacturer Link; ComponentLink1URL: http://www.irf.com/; ComponentLink2Description: Datasheet; ComponentLink2URL: http://www.irf.com/product-info/datasheets/data/10tq.pdf
D4 D6 = Diode 1N4148: High Conductance Fast Diode; Published: 8-Jun-2000; LatestRevisionDate: 17-Jul-2002; LatestRevisionNote: Re-released for DXP Platform.; DatasheetVersion: 1997; PackageReference: DO-35; Publisher: Altium Limited; PackageDescription: Diode, Axial; Body 3.8 x 1.9 mm (LxDia. max), Lead Dia. 0.53 mm (max); Code_JEDEC: DO-204-AH; ComponentLink1Description: Manufacturer Link; ComponentLink1URL: http://www.fairchildsemi.com/; ComponentLink2Description: Datasheet; ComponentLink2URL: http://www.fairchildsemi.com/ds/1N%2F1N4148.pdf
L2 = Inductor: Code_IEC: 1005; Published: 8-Jun-2000; LatestRevisionDate: 29-May-2009; LatestRevisionNote: IPC-7351 Footprint Added.; PackageReference: 0402-A; Publisher: Altium Limited; PackageDescription: Chip Inductor; Code_JEITA: 0402
Q1-Q6 = NMOS: pin to pad: D>1 G>3 S>2
R4 R5 R7 R20-R38 R43 = RESISTOR0402-RES: as R701 on sheet sonar_tx

## Sheet rk3288.SchDoc
size A4
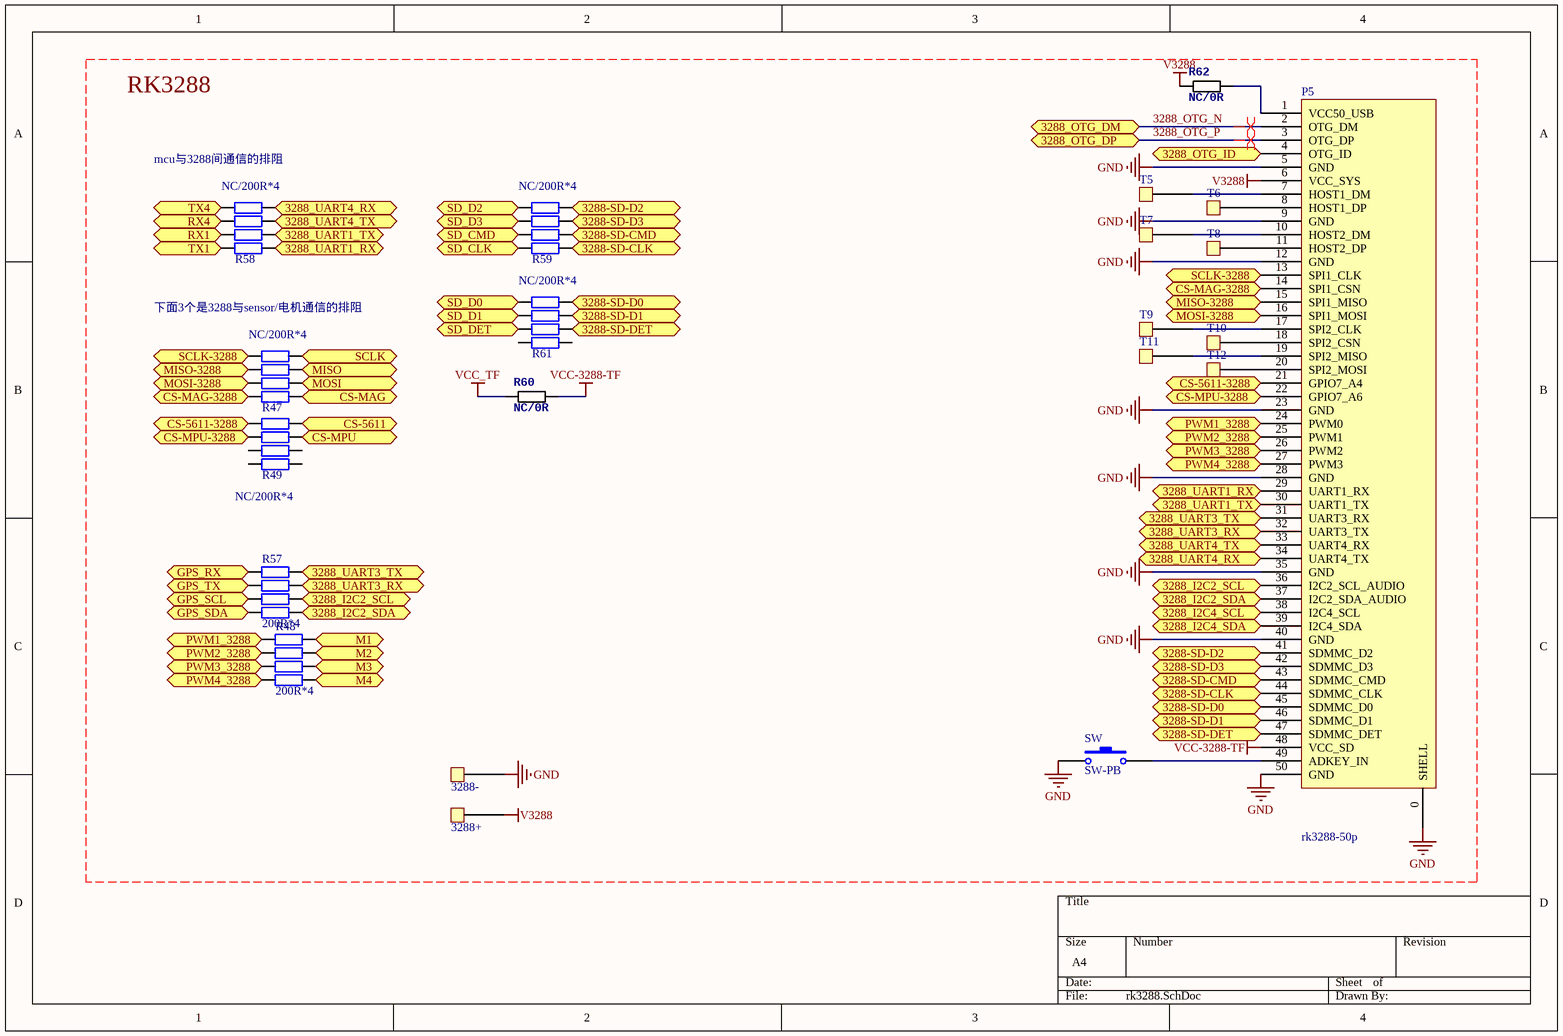
[diagram p7: rk3288.SchDoc]

### Parts
3288+  TestPad  [BatteryHole - 2mm]  (value not drawn)
3288-  TestPad  [BatteryHole - 2mm]  (value not drawn)
P5  rk3288-50p  [FPC-0.5mm-50-revert]
R47  NC/200R*4  [0402X4]
R48  200R*4  [0402X4]
R49  NC/200R*4  [0402X4]
R57  200R*4  [0402X4]
R58  NC/200R*4  [0402X4]
R59  NC/200R*4  [0402X4]
R60  NC/0R  [0402]
R61  NC/200R*4  [0402X4]
R62  NC/0R  [0402]
SW  SW-PB  [SW1]
T5  TestPad  [TestPad - 1mm]  (value not drawn)
T6  TestPad  [TestPad - 1mm]  (value not drawn)
T7  TestPad  [TestPad - 1mm]  (value not drawn)
T8  TestPad  [TestPad - 1mm]  (value not drawn)
T9  TestPad  [TestPad - 1mm]  (value not drawn)
T10  TestPad  [TestPad - 1mm]  (value not drawn)
T11  TestPad  [TestPad - 1mm]  (value not drawn)
T12  TestPad  [TestPad - 1mm]  (value not drawn)

### Ports
3288-SD-CLK, 3288-SD-CMD, 3288-SD-D0, 3288-SD-D1, 3288-SD-D2, 3288-SD-D3, 3288-SD-DET, 3288_I2C2_SCL, 3288_I2C2_SDA, 3288_I2C4_SCL, 3288_I2C4_SDA, 3288_OTG_DM, 3288_OTG_DP, 3288_OTG_ID, 3288_UART1_RX, 3288_UART1_TX, 3288_UART3_RX, 3288_UART3_TX, 3288_UART4_RX, 3288_UART4_TX, CS-5611, CS-5611-3288, CS-MAG (bidir), CS-MAG-3288 (bidir), CS-MPU, CS-MPU-3288, GPS_RX, GPS_SCL, GPS_SDA, GPS_TX, M1, M2, M3, M4, MISO, MISO-3288, MOSI, MOSI-3288, PWM1_3288, PWM2_3288, PWM3_3288, PWM4_3288, RX1, RX4, SCLK, SCLK-3288, SD_CLK, SD_CMD, SD_D0, SD_D1, SD_D2, SD_D3, SD_DET, TX1, TX4

### Nets
GND: 3288-.1 P5.0(SHELL) P5.5(GND) P5.9(GND) P5.12(GND) P5.23(GND) P5.28(GND) P5.35(GND) P5.40(GND) P5.50(GND) SW.1
V3288: 3288+.1 P5.6(VCC_SYS) R62.1
VCC-3288-TF: P5.48(VCC_SD) R60.2
VCC_TF: R60.1
3288_OTG_N: P5.2(OTG_DM) ; port 3288_OTG_DM
3288_OTG_P: P5.3(OTG_DP) ; port 3288_OTG_DP
NetBaro1_5: R49.8 ; port CS-5611
NetBaro1_6: R47.7 ; port MISO
NetBaro1_7: R47.6 ; port MOSI
NetBaro1_8: R47.8 ; port SCLK
NetGPS1_3: R57.6 ; port GPS_TX
NetGPS1_4: R57.5 ; port GPS_RX
NetGPS1_5: R57.7 ; port GPS_SCL
NetGPS1_6: R57.8 ; port GPS_SDA
Netimu1_8: R49.7 ; port CS-MPU
NetM1_2: R48.1 ; port M1
NetM2_2: R48.2 ; port M2
NetM3_2: R48.3 ; port M3
NetM4_2: R48.4 ; port M4
NetMCU1_14: R58.1 ; port TX4
NetMCU1_15: R58.2 ; port RX4
NetMCU1_42: R58.4 ; port TX1
NetMCU1_43: R58.3 ; port RX1
NetP5_1: P5.1(VCC50_USB) R62.2
NetP5_4: P5.4(OTG_ID) ; port 3288_OTG_ID
NetP5_7: P5.7(HOST1_DM) T5.1
NetP5_8: P5.8(HOST1_DP) T6.1
NetP5_10: P5.10(HOST2_DM) T7.1
NetP5_11: P5.11(HOST2_DP) T8.1
NetP5_13: P5.13(SPI1_CLK) R47.1 ; port SCLK-3288
NetP5_14: P5.14(SPI1_CSN) R47.4 ; port CS-MAG-3288
NetP5_15: P5.15(SPI1_MISO) R47.2 ; port MISO-3288
NetP5_16: P5.16(SPI1_MOSI) R47.3 ; port MOSI-3288
NetP5_17: P5.17(SPI2_CLK) T9.1
NetP5_18: P5.18(SPI2_CSN) T10.1
NetP5_19: P5.19(SPI2_MISO) T11.1
NetP5_20: P5.20(SPI2_MOSI) T12.1
NetP5_21: P5.21(GPIO7_A4) R49.1 ; port CS-5611-3288
NetP5_22: P5.22(GPIO7_A6) R49.2 ; port CS-MPU-3288
NetP5_24: P5.24(PWM0) R48.8 ; port PWM1_3288
NetP5_25: P5.25(PWM1) R48.7 ; port PWM2_3288
NetP5_26: P5.26(PWM2) R48.6 ; port PWM3_3288
NetP5_27: P5.27(PWM3) R48.5 ; port PWM4_3288
NetP5_29: P5.29(UART1_RX) R58.5 ; port 3288_UART1_RX
NetP5_30: P5.30(UART1_TX) R58.6 ; port 3288_UART1_TX
NetP5_31: P5.31(UART3_RX) R57.4 ; port 3288_UART3_TX
NetP5_32: P5.32(UART3_TX) R57.3 ; port 3288_UART3_RX
NetP5_33: P5.33(UART4_RX) R58.7 ; port 3288_UART4_TX
NetP5_34: P5.34(UART4_TX) R58.8 ; port 3288_UART4_RX
NetP5_36: P5.36(I2C2_SCL_AUDIO) R57.2 ; port 3288_I2C2_SCL
NetP5_37: P5.37(I2C2_SDA_AUDIO) R57.1 ; port 3288_I2C2_SDA
NetP5_38: P5.38(I2C4_SCL) ; port 3288_I2C4_SCL
NetP5_39: P5.39(I2C4_SDA) ; port 3288_I2C4_SDA
NetP5_41: P5.41(SDMMC_D2) R59.8 ; port 3288-SD-D2
NetP5_42: P5.42(SDMMC_D3) R59.7 ; port 3288-SD-D3
NetP5_43: P5.43(SDMMC_CMD) R59.6 ; port 3288-SD-CMD
NetP5_44: P5.44(SDMMC_CLK) R59.5 ; port 3288-SD-CLK
NetP5_45: P5.45(SDMMC_D0) R61.8 ; port 3288-SD-D0
NetP5_46: P5.46(SDMMC_D1) R61.7 ; port 3288-SD-D1
NetP5_47: P5.47(SDMMC_DET) R61.6 ; port 3288-SD-DET
NetP5_49: P5.49(ADKEY_IN) SW.2
NetR1_4: R47.5 ; port CS-MAG
NetR45_2: R59.2 ; port SD_D3
NetR45_3: R59.1 ; port SD_D2
NetR46_1: R61.2 ; port SD_D1
NetR46_2: R61.1 ; port SD_D0
NetR46_3: R59.4 ; port SD_CLK
NetR46_4: R59.3 ; port SD_CMD
NetR61_3: R61.3 ; port SD_DET

Not connected (* = marked no-connect by the designer): R49 3 4 5 6; R61 4 5

### Layout directives
differential pair: 3288_OTG_N, 3288_OTG_P

### Notes on the sheet
- RK3288
- (near R58) mcu与3288间通信的排阻
- 下面3个是3288与sensor/电机通信的排阻

### Library data of the parts
R47-R49 R57-R59 R61 = Res*4: Resistor; Published: 8-Jun-2000; LatestRevisionDate: 17-Jul-2002; LatestRevisionNote: Re-released for DXP Platform.; PackageReference: AXIAL-0.4; Publisher: Altium Limited; PackageDescription: Axial Device, Thru-Hole; 2 Leads; 0.4 in Pin Spacing
R60 R62 = RESISTOR0603B: as R64 on sheet sonar_rx
SW = SW-PB: Switch; Published: 24-Mar-1999; LatestRevisionDate: 17-Jul-2002; LatestRevisionNote: Re-released for DXP Platform.; PackageReference: SPST-2; Publisher: Altium Limited; PackageDescription: Switch; 2 Leads

## Nets that join several sheets
3.3A: power (C14.1 C15.1 U2.5), mcu (MCU1.13 R50.1), sensor (7 pins)
3.3D: power (C12.1 C13.1 U1.5), mcu (15 pins)
5V: sonar_tx (C702.1 L701.1 U702.3), sonar_rx (rx-L1.1), power (9 pins), mcu (debug1.5 PPM1.2 R?#1.1 USB1.1), sensor (GPS1.1), connector (Q9.S R41.2), PiAttachment (7 pins)
GND: sonar_tx (8 pins), sonar_rx (R64.1), power (26 pins), mcu (20 pins), sensor (14 pins), connector (11 pins), PiAttachment (23 pins), rk3288 (11 pins)
V3288: connector (Q9.D), rk3288 (3288+.1 P5.6 R62.1)
VBAT: power (Bat+.1 R9.P$2 R13.1 U6.4), PiAttachment (R4.2)
VCC_TF: mcu (0R/NC.1), connector (C37.2 TF1.4), rk3288 (R60.1)
VSYS: power (5 pins), connector (Q7.S R39.2)
3288_OTG_N: mcu (R53.2), rk3288 (P5.2)
3288_OTG_P: mcu (R54.2), rk3288 (P5.3)
NetBaro1_5: mcu (R2.7), sensor (Baro1.5), rk3288 (R49.8)
NetBaro1_6: mcu (R1.2), sensor (Baro1.6 imu1.9 U8.5), rk3288 (R47.7)
NetBaro1_7: mcu (R1.3), sensor (Baro1.7 imu1.24 U8.16), rk3288 (R47.6)
NetBaro1_8: mcu (R1.1), sensor (Baro1.8 imu1.23 U8.1), rk3288 (R47.8)
NetC18_1: power (C18.1 R12.2), mcu (MCU1.17)
NetC26_1: power (C26.1 R13.2 R16.2), mcu (MCU1.16)
NetC33_1: power (C33.1 R18.1 T13.1 U4.3), mcu (D3.2), PiAttachment (D4.2)
NetD4_1: mcu (R44.1), PiAttachment (D4.1 D6.2 P1.2 R26.1)
NetGPS1_3: mcu (R56.8), sensor (GPS1.3), rk3288 (R57.6)
NetGPS1_4: mcu (R56.7), sensor (GPS1.4), rk3288 (R57.5)
NetGPS1_5: mcu (R56.6), sensor (GPS1.5), rk3288 (R57.7)
NetGPS1_6: mcu (R56.5), sensor (GPS1.6), rk3288 (R57.8)
Netimu1_8: mcu (R2.8), sensor (imu1.8), rk3288 (R49.7)
NetM1_2: mcu (R63.1), connector (M1.2), rk3288 (R48.1)
NetM2_2: mcu (R63.2), connector (M2.2), rk3288 (R48.2)
NetM3_2: mcu (R63.3), connector (M3.2), rk3288 (R48.3)
NetM4_2: mcu (R63.4), connector (M4.2), rk3288 (R48.4)
NetMCU1_14: mcu (MCU1.14), rk3288 (R58.1)
NetMCU1_15: mcu (MCU1.15), rk3288 (R58.2)
NetMCU1_24: sonar_tx (R701.2), mcu (MCU1.24)
NetMCU1_25: sonar_rx (RX-R9.2), mcu (MCU1.25)
NetMCU1_29: mcu (MCU1.29), PiAttachment (Q2.G R20.1)
NetMCU1_30: mcu (MCU1.30), PiAttachment (Q1.G R7.1)
NetMCU1_42: mcu (MCU1.42 R56.2), rk3288 (R58.4)
NetMCU1_43: mcu (MCU1.43 R56.1), rk3288 (R58.3)
NetMCU1_58: mcu (MCU1.58), PiAttachment (Q4.G R22.1)
NetMCU1_59: mcu (MCU1.59), PiAttachment (Q5.G R23.1)
NetMCU1_61: mcu (MCU1.61), PiAttachment (Q6.G R24.1)
NetMCU1_62: mcu (MCU1.62), PiAttachment (Q3.G R21.1)
NetP5_4: mcu (R55.2), rk3288 (P5.4)
NetR1_4: mcu (R1.4), sensor (U8.4), rk3288 (R47.5)
NetR43_2: mcu (R65.2), PiAttachment (R43.2 U5.3)
NetR45_2: mcu (R45.2), connector (TF1.2), rk3288 (R59.2)
NetR45_3: mcu (R45.3), connector (TF1.1), rk3288 (R59.1)
NetR46_1: mcu (R46.1), connector (TF1.8), rk3288 (R61.2)
NetR46_2: mcu (R46.2), connector (TF1.7), rk3288 (R61.1)
NetR46_3: mcu (R46.3), connector (TF1.5), rk3288 (R59.4)
NetR46_4: mcu (R46.4), connector (TF1.3), rk3288 (R59.3)
NetR61_3: connector (TF1.9), rk3288 (R61.3)